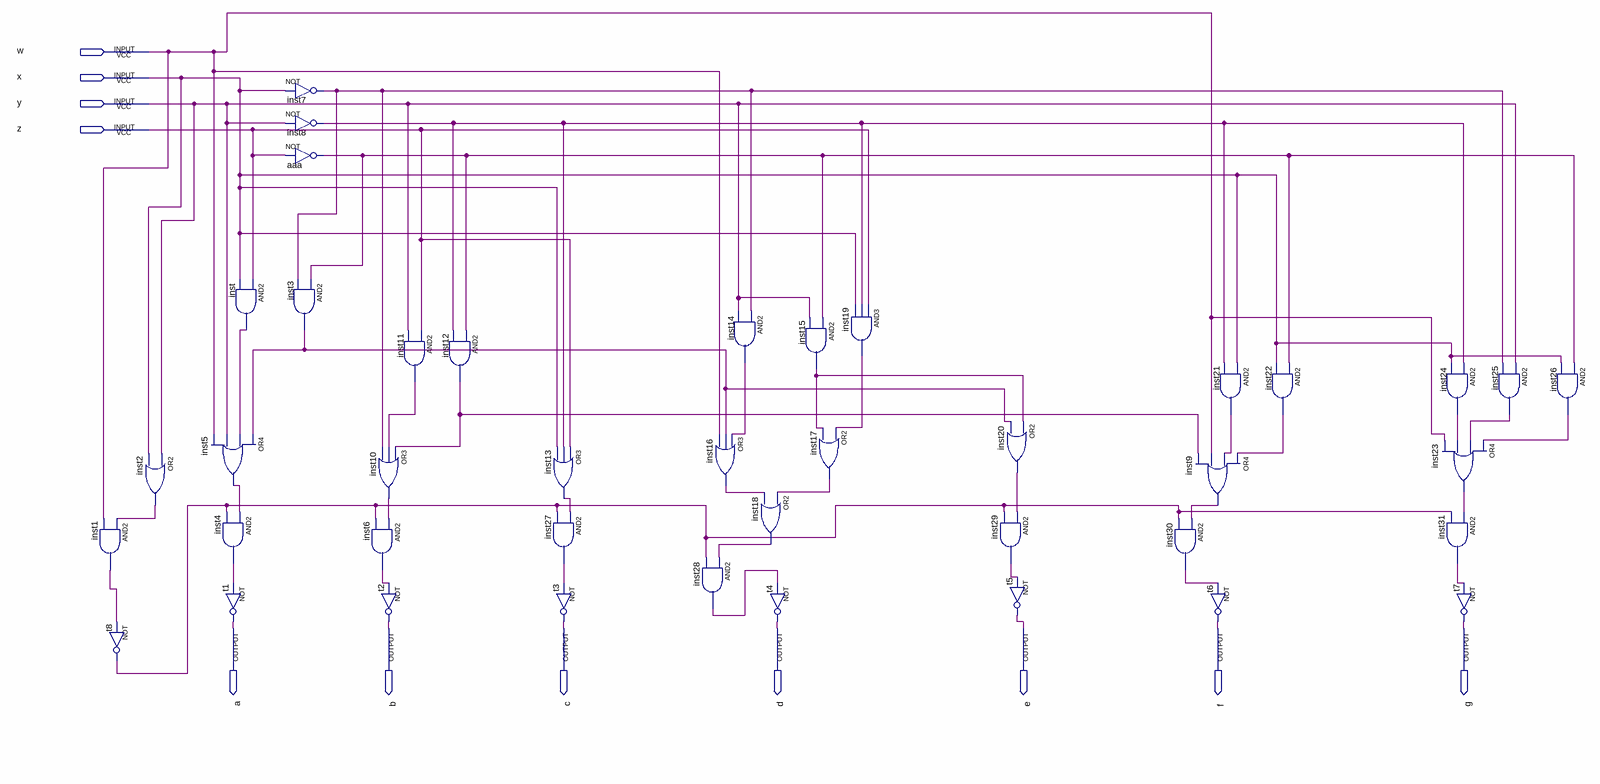
[diagram p0: schematic sheet]
// Quartus schematic Decodificator.bdf as structural Verilog: 41 symbols, 11 pins
module Decodificator (
  input  w,
  input  x,
  input  y,
  input  z,
  output a,
  output b,
  output c,
  output d,
  output e,
  output f,
  output g
);

  wire aaa_out, inst1_out, inst2_out, inst3_out, inst4_out, inst5_out, inst6_out, inst7_out, inst8_out,
       inst9_out, inst10_out, inst11_out, inst12_out, inst13_out, inst14_out, inst15_out, inst16_out,
       inst17_out, inst18_out, inst19_out, inst20_out, inst21_out, inst22_out, inst23_out, inst24_out,
       inst25_out, inst26_out, inst27_out, inst28_out, inst29_out, inst30_out, inst31_out, inst_out, t8_out;

  and inst1 (inst1_out, inst2_out, w);
  not t8 (t8_out, inst1_out);
  or inst2 (inst2_out, y, x);
  or inst5 (inst5_out, inst3_out, inst_out, y, w);
  and inst4 (inst4_out, inst5_out, t8_out);
  and inst (inst_out, z, x);
  not t1 (a, inst4_out);
  not inst7 (inst7_out, x);
  not inst8 (inst8_out, y);
  not aaa (aaa_out, z);
  and inst3 (inst3_out, aaa_out, inst7_out);
  or inst10 (inst10_out, inst12_out, inst11_out, inst7_out);
  and inst6 (inst6_out, inst10_out, t8_out);
  and inst11 (inst11_out, z, y);
  not t2 (b, inst6_out);
  and inst12 (inst12_out, aaa_out, inst8_out);
  or inst13 (inst13_out, z, inst8_out, x);
  and inst27 (inst27_out, inst13_out, t8_out);
  not t3 (c, inst27_out);
  and inst14 (inst14_out, inst7_out, y);
  or inst16 (inst16_out, inst14_out, inst3_out, w);
  and inst28 (inst28_out, inst18_out, t8_out);
  or inst18 (inst18_out, inst17_out, inst16_out);
  not t4 (d, inst28_out);
  and inst15 (inst15_out, aaa_out, y);
  or inst17 (inst17_out, inst19_out, inst15_out);
  and inst19 (inst19_out, z, inst8_out, x);
  and inst29 (inst29_out, inst20_out, t8_out);
  or inst20 (inst20_out, inst15_out, inst3_out);
  not t5 (e, inst29_out);
  or inst9 (inst9_out, inst22_out, inst21_out, w, inst12_out);
  and inst30 (inst30_out, inst9_out, t8_out);
  and inst21 (inst21_out, x, inst8_out);
  not t6 (f, inst30_out);
  and inst22 (inst22_out, aaa_out, x);
  and inst24 (inst24_out, inst8_out, x);
  or inst23 (inst23_out, inst26_out, inst25_out, inst24_out, w);
  and inst31 (inst31_out, inst23_out, t8_out);
  not t7 (g, inst31_out);
  and inst25 (inst25_out, y, inst7_out);
  and inst26 (inst26_out, aaa_out, x);
endmodule
